# Altium schematic sheet Sheet1.SchDoc
size A4
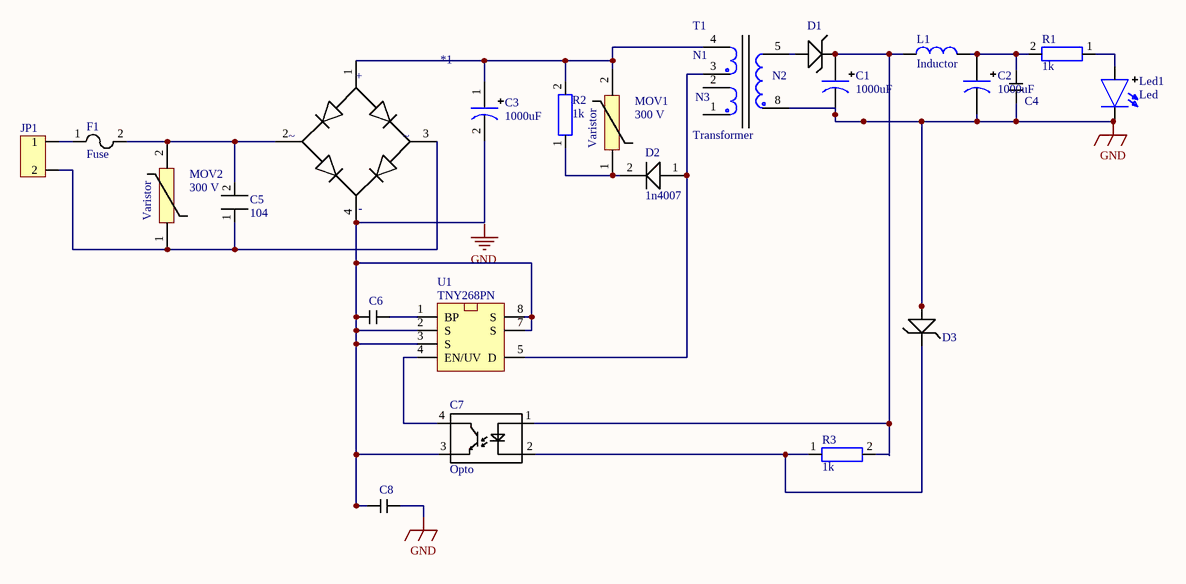
[diagram p0: Sheet1.SchDoc]

## Parts
*1  Bridge diode  [bridge diode - duplicate]  (value not drawn)
C1  1000uF  [Capacitor 1000uF 25V]
C2  1000uF  [Capacitor 1000uF 25V]
C3  1000uF  [Capacitor 1000uF 25V]
C4  104  [Capacitor 104]  (value not drawn)
C5  104  [Capactor cbb]
C6  104  [Capacitor 104]  (value not drawn)
C7  Opto  [Opto]
C8  104  [Capactor cbb]  (value not drawn)
D1  Diode zenner  [Diode Zenner]  (value not drawn)
D2  1n4007  [Diode 1N4007]
D3  Diode zenner  [Diode Zenner]  (value not drawn)
F1  Fuse  [Fuse]
JP1  Header kf128  [Terminal 2]  (value not drawn)
L1  Inductor  [RLB 0712 Inductor]
Led1  Led  [LED RED]
MOV1  300 V  [Varistor 10d471k]
MOV2  300 V  [Varistor 10d471k]
R1  1k  [Resistor 1/4w]
R2  1k  [Resistor 1/4w - duplicate]
R3  1k  [Resistor 1/4w - duplicate]
T1  Transformer  [Transformer]
U1  TNY268PN  [TNY268pn]  (value not drawn)

## Nets
GND: C1.2 C2.2 C4.1 C8.2 D3.1 Led1.2 T1.8
Net*1_1: *1.1 C3.1 MOV1.2 R2.2 T1.4
Net*1_2: *1.2 C5.2 F1.2 MOV2.2
Net*1_3: *1.3 C5.1 JP1.2 MOV2.1
Net*1_4: *1.4 C3.2 C6.1 C7.3 C8.1 U1.2(S) U1.3(S) U1.7(S) U1.8(S)
NetC1_1: C1.1 C7.1 D1.2 L1.1
NetC2_1: C2.1 C4.2 L1.2 R1.2
NetC6_2: C6.2 U1.1(BP)
NetC7_2: C7.2 D3.2 R3.1
NetC7_4: C7.4 U1.4(EN/UV)
NetD1_1: D1.1 T1.5
NetD2_1: D2.1 T1.3 U1.5(D)
NetD2_2: D2.2 MOV1.1 R2.1
NetF1_1: F1.1 JP1.1
NetLed1_1: Led1.1 R1.1

Not connected (* = marked no-connect by the designer): R3 2; T1 1 2

## Notes on the sheet
- Labels drawn without touching a wire or pin: GND
- (in symbol Bridge diode) +; ~; -
- (in symbol Transformer) N1; N2; N3
- (in symbol Varistor 10d471k) Varistor

## Library data of the parts
C1-C3 = Capacitor Pol
C4-C6 C8 = Capactor
C7 = Opto: PC817
D2 = Diode: diode 1n4007
JP1 = Header kf128: Header kf128 banlinhkien
Led1 = Led: Led Red
MOV1 MOV2 = Varistor 10d471k: Varistor mov 10d471k   12 - 300 V
R1-R3 = Resister
T1 = Transformer: BAX EE10-Q7LK6 pin